# Altium schematic sheet Sheet1.SchDoc
size A
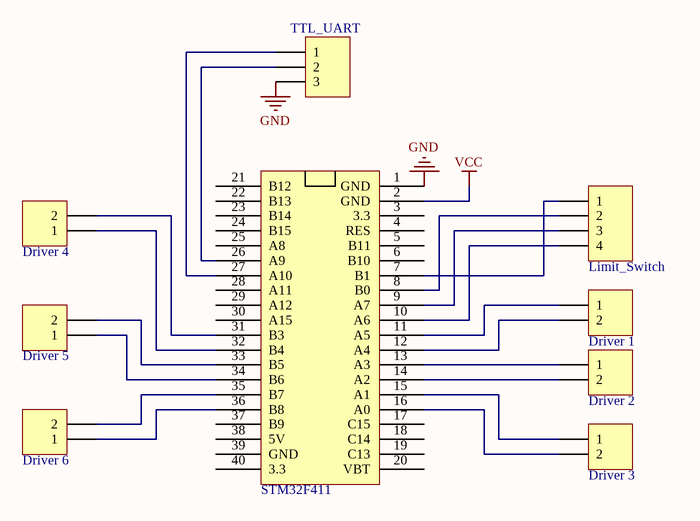
[diagram p0: Sheet1.SchDoc]

## Parts
*1  STM32F411  [STM32F103]
P1  TTL_UART  [HDR1X3]
P2  Limit_Switch  [HDR1X4]
P3  Driver 4  [HDR1X2]
P4  Driver 1  [HDR1X2]
P5  Driver 5  [HDR1X2]
P6  Driver 2  [HDR1X2]
P7  Driver 6  [HDR1X2]
P8  Driver 3  [HDR1X2]

## Nets
GND: *1.1(GND) P1.3
VCC: *1.2(GND)
Net*1_7: *1.7(B1) P2.1
Net*1_8: *1.8(B0) P2.2
Net*1_9: *1.9(A7) P2.3
Net*1_10: *1.10(A6) P2.4
Net*1_11: *1.11(A5) P4.1
Net*1_12: *1.12(A4) P4.2
Net*1_13: *1.13(A3) P6.1
Net*1_14: *1.14(A2) P6.2
Net*1_15: *1.15(A1) P8.1
Net*1_16: *1.16(A0) P8.2
Net*1_26: *1.26(A9) P1.2
Net*1_27: *1.27(A10) P1.1
Net*1_31: *1.31(B3) P3.2
Net*1_32: *1.32(B4) P3.1
Net*1_33: *1.33(B5) P5.2
Net*1_34: *1.34(B6) P5.1
Net*1_35: *1.35(B7) P7.2
Net*1_36: *1.36(B8) P7.1

Not connected (* = marked no-connect by the designer): *1 3(3.3) 4(RES) 5(B11) 6(B10) 17(C15) 18(C14) 19(C13) 20(VBT) 21(B12) 22(B13) 23(B14) 24(B15) 25(A8) 28(A11) 29(A12) 30(A15) 37(B9) 38(5V) 39(GND) 40(3.3)

## Library data of the parts
*1 = STM32F103
P1 = Header 3: Header, 3-Pin; LatestRevisionDate: 17-Jul-2002; LatestRevisionNote: Re-released for DXP Platform.; Publisher: Altium Limited
P2 = Header 4: Header, 4-Pin; LatestRevisionDate: 17-Jul-2002; LatestRevisionNote: Re-released for DXP Platform.; Publisher: Altium Limited
P3-P8 = Header 2: Header, 2-Pin; LatestRevisionDate: 17-Jul-2002; LatestRevisionNote: Re-released for DXP Platform.; Publisher: Altium Limited